# Altium schematic sheet main.SchDoc
size A
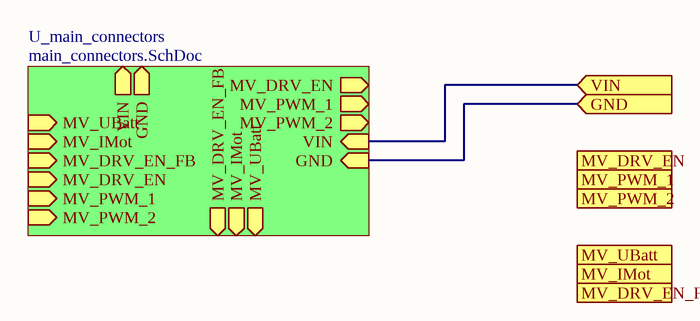
[diagram p0: main.SchDoc]

## Sub-sheets
U_main_connectors = main_connectors.SchDoc: VIN (in), GND (in), MV_DRV_EN (out), MV_PWM_1 (out), MV_PWM_2 (out), MV_UBatt (in), MV_IMot (in), MV_DRV_EN_FB (in), VIN (out), GND (out), MV_DRV_EN (in), MV_PWM_1 (in), MV_PWM_2 (in), MV_UBatt (out), MV_IMot (out), MV_DRV_EN_FB (out)

## Ports
GND (in), MV_DRV_EN (out), MV_DRV_EN_FB (in), MV_IMot (in), MV_PWM_1 (out), MV_PWM_2 (out), MV_UBatt (in), VIN (in)

## Nets
GND: port GND, sheet U_main_connectors/GND
VIN: port VIN, sheet U_main_connectors/VIN